# Altium project HuanserBoard.PrjPcb
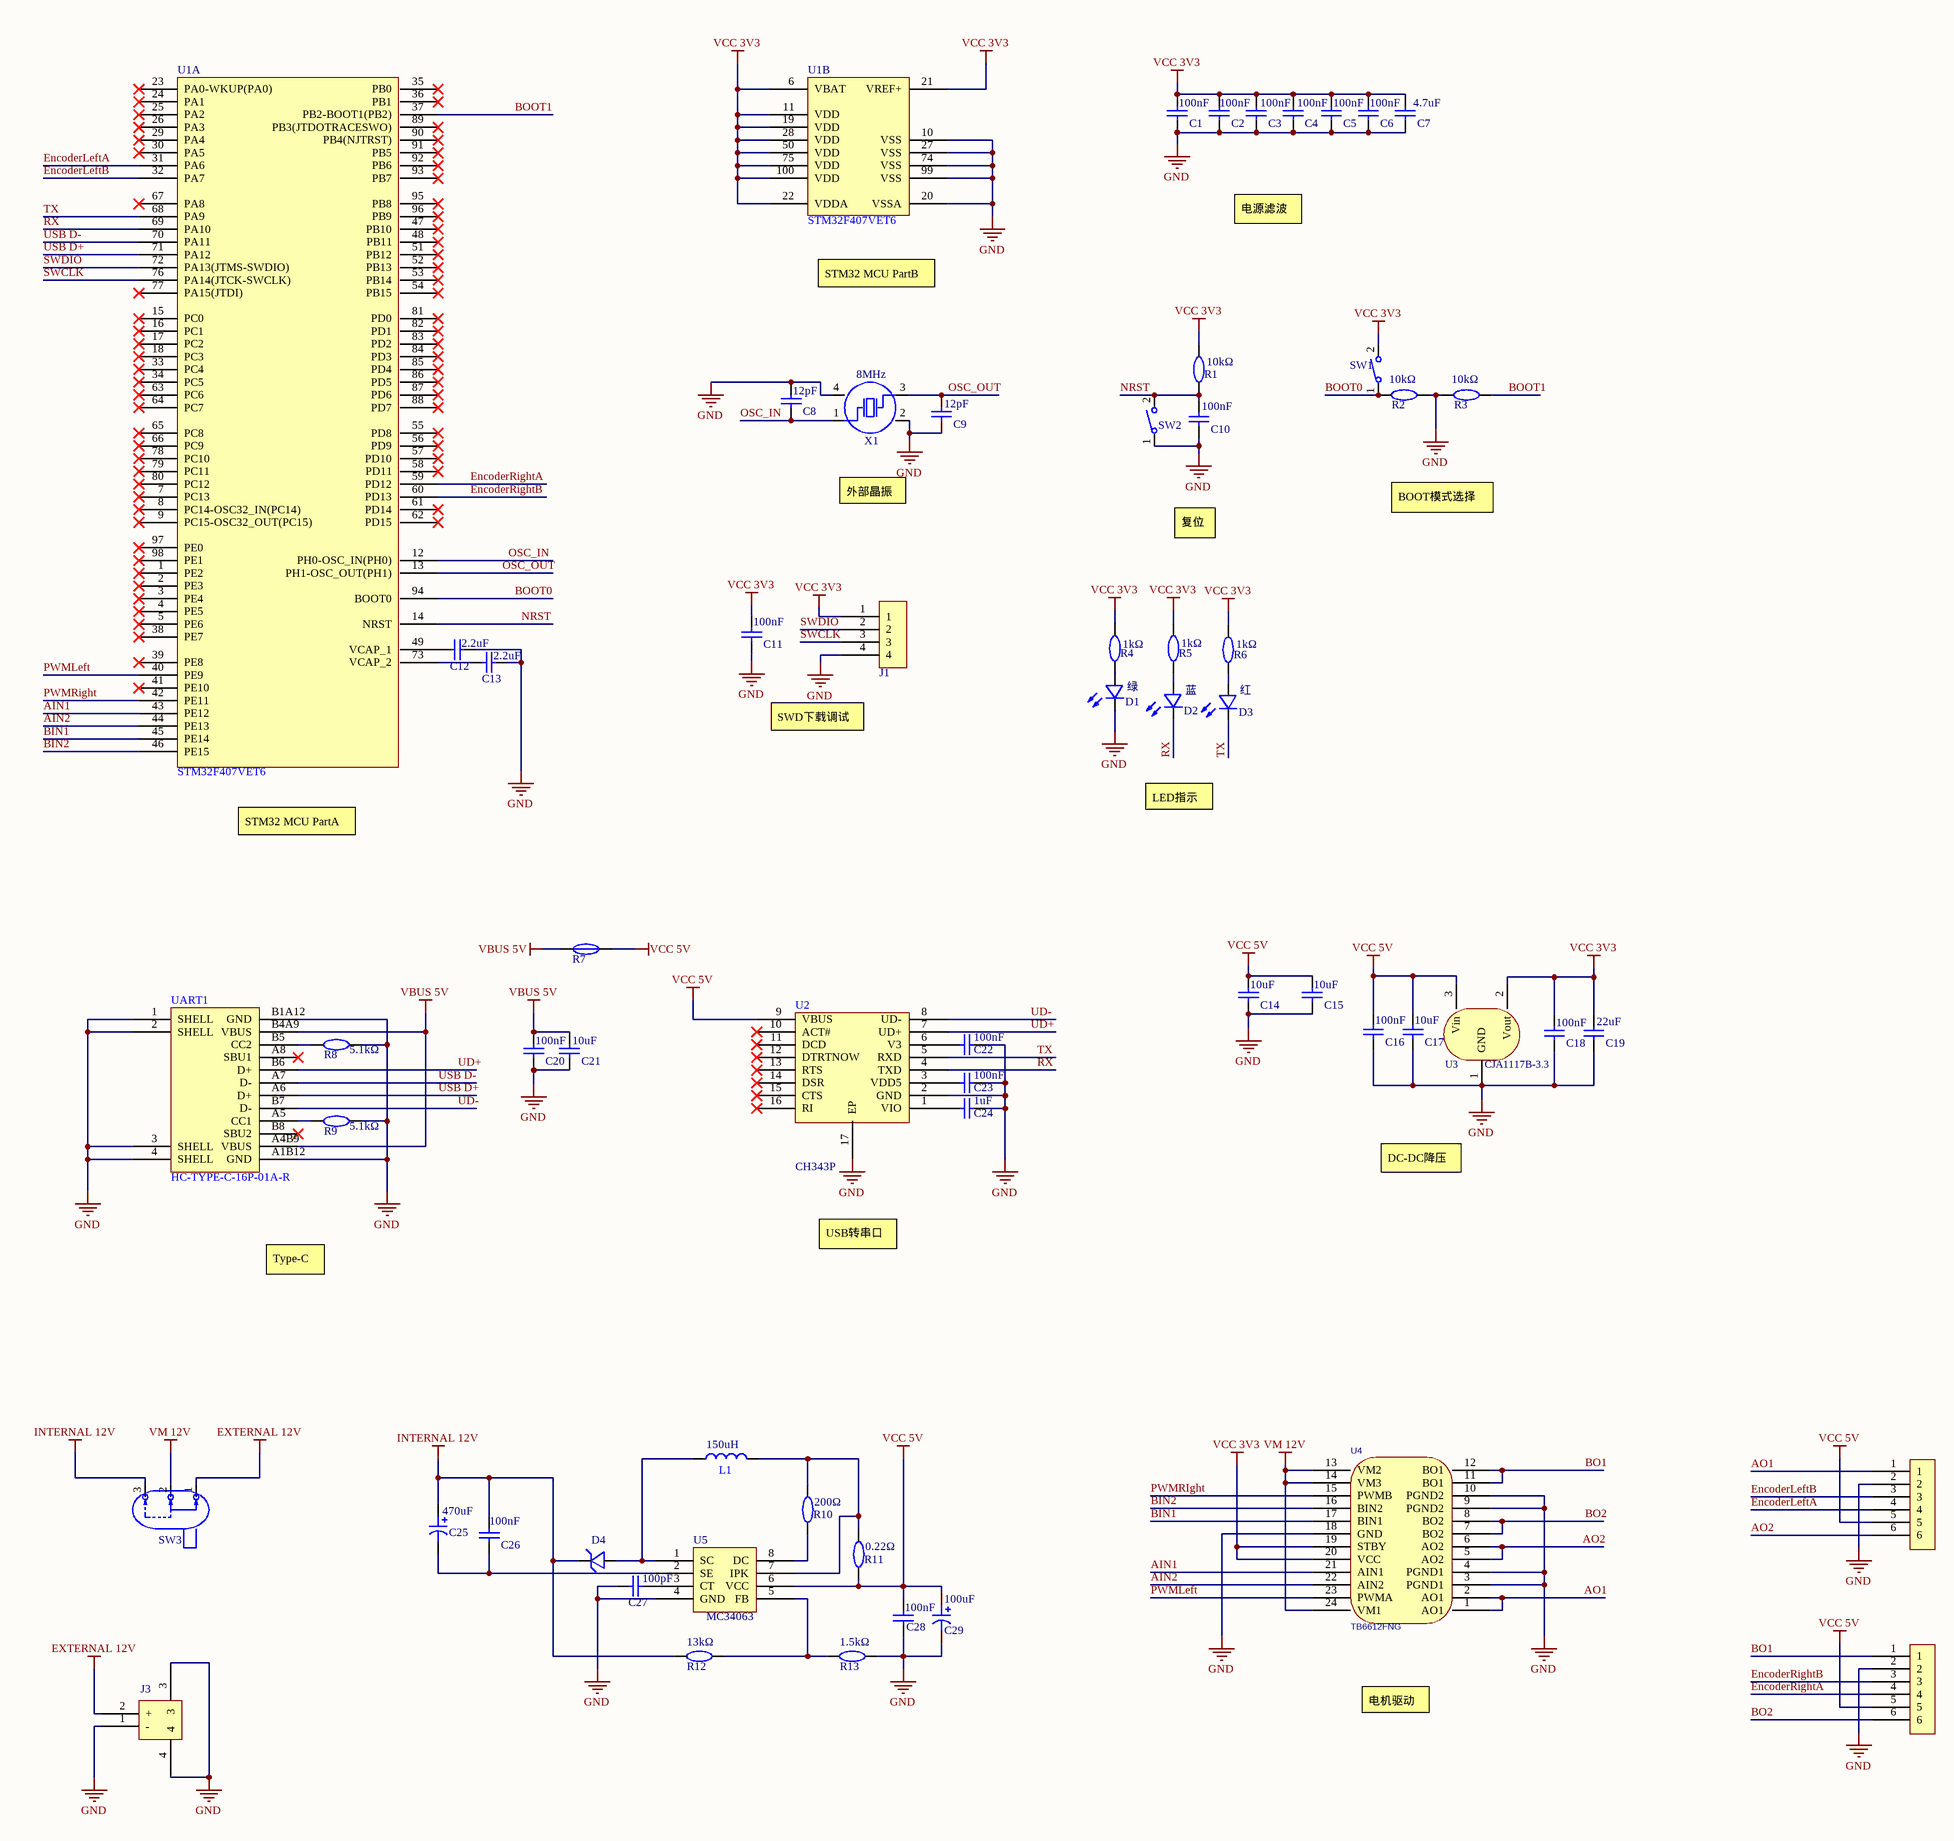
[diagram p0: MotorControl.SchDoc]
1 sheet, 61 parts. Net scope: global (net labels, ports and power ports of the same name join across sheets).
Board file: MotorControl.PcbDoc

## Sheet MotorControl.SchDoc
size A2

### Parts
C1  CAP-0402  [C0402]  (value not drawn)
C2  CAP-0402  [C0402]  (value not drawn)
C3  CAP-0402  [C0402]  (value not drawn)
C4  CAP-0402  [C0402]  (value not drawn)
C5  CAP-0402  [C0402]  (value not drawn)
C6  CAP-0402  [C0402]  (value not drawn)
C7  CAP-0402  [C0402]  (value not drawn)
C8  CAP-0402  [C0402]  (value not drawn)
C9  CAP-0402  [C0402]  (value not drawn)
C10  CAP-0402  [C0402]  (value not drawn)
C11  CAP-0402  [C0402]  (value not drawn)
C12  CAP-0402  [C0402]  (value not drawn)
C13  CAP-0402  [C0402]  (value not drawn)
C14  CAP-0402  [C0402]  (value not drawn)
C15  CAP-0402  [C0402]  (value not drawn)
C16  CAP-0402  [C0402]  (value not drawn)
C17  CAP-0402  [C0402]  (value not drawn)
C18  CAP-0402  [C0402]  (value not drawn)
C19  CAP-0402  [C0402]  (value not drawn)
C20  CAP-0402  [C0402]  (value not drawn)
C21  CAP-0402  [C0402]  (value not drawn)
C22  CAP-0402  [C0402]  (value not drawn)
C23  CAP-0402  [C0402]  (value not drawn)
C24  CAP-0402  [C0402]  (value not drawn)
C25  470uF  [CAP-SMD_BD6.3-L6.6-W6.6-LS7.6-RD]  (value not drawn)
C26  CAP-0402  [C0402]  (value not drawn)
C27  CAP-0402  [C0402]  (value not drawn)
C28  CAP-0402  [C0402]  (value not drawn)
C29  100uF  [CAP-SMD_BD6.3-L6.6-W6.6-LS7.2-FD]  (value not drawn)
D1  LED0805-RD  [LED0805-RD]  (value not drawn)
D2  LED0805-RD  [LED0805-RD]  (value not drawn)
D3  LED0805-RD  [LED0805-RD]  (value not drawn)
D4  SS34A  [SMA_L4.4-W2.6-LS5.1-RD]  (value not drawn)
J1  HDR-1X4  [HDR-TH_4P-P2.54-H-M-W10.4]  (value not drawn)
J2  WAFER-XH254WZ-6A  [CONN-TH_6P-P2.50_WAFER-XH254WZ-6A]  (value not drawn)
J3  XT30PW-M30.G.Y  [CONN-TH_XT30PW-M]  (value not drawn)
J4  WAFER-XH254WZ-6A  [CONN-TH_6P-P2.50_WAFER-XH254WZ-6A]  (value not drawn)
L1  (no value)  [IND-SMD_L12.5-W12.5_GSDRK127P]
R1  RES-0402  [R0402]  (value not drawn)
R2  RES-0402  [R0402]  (value not drawn)
R3  RES-0402  [R0402]  (value not drawn)
R4  RES-0402  [R0402]  (value not drawn)
R5  RES-0402  [R0402]  (value not drawn)
R6  RES-0402  [R0402]  (value not drawn)
R7  TLC F1206  [F1206]  (value not drawn)
R8  RES-0402  [R0402]  (value not drawn)
R9  RES-0402  [R0402]  (value not drawn)
R10  RES-0402  [R0402]  (value not drawn)
R11  RES-0402  [R0402]  (value not drawn)
R12  RES-0402  [R0402]  (value not drawn)
R13  RES-0402  [R0402]  (value not drawn)
SW1  Switch  [KEY-SMD_2P-L6.0-W3.6-P7.4-LS8.0-L]  (value not drawn)
SW2  Switch  [KEY-SMD_2P-L6.0-W3.6-P7.4-LS8.0-L]  (value not drawn)
SW3  Switch-弯插滑动开关  [SW-TH_3P-SS12D06-1]  (value not drawn)
U1  STM32F407VET6  [LQFP-100_L14.0-W14.0-P0.50-LS16.0-BL]  (parts A,B of 2)
U2  CH343P  [TQFN-16_L3.0-W3.0-P0.50-BL-EP1.7]
U3  CJA1117B-3.3  [SOT-89]
U4  TB6612FNG  [SSOP-24_L8.4-W5.8-P0.65-LS7.8-BL]
U5  MC34063  [SOP-8_L4.9-W3.9-P1.27-LS6.0-BL]
UART1  HC-TYPE-C-16P-01A-R  [USB-C-SMD_G-SWITCH_GT-USB-7010EN]
X1  OSC CRYSTAL-SMD_4P-L3.2-W2.5-BL  [CRYSTAL-SMD_4P-L3.2-W2.5-BL]  (value not drawn)

### Nets
EXTERNAL 12V: J3.2(+) SW3.1
GND: C1.1 C2.1 C3.1 C4.1 C5.1 C6.1 C7.1 C8.2 C9.1 C10.1 C11.1 C12.2 C13.2 C14.1 C15.1 C16.1 C17.1 C18.1 C19.1 C20.1 C21.1 C22.2 C23.2 C24.2 C27.1 C28.1 C29.2 D1.1(-) J1.4 J2.2 J3.1(-) J3.3 J3.4 J4.2 R2.2 R3.1 R8.2 R9.2 R13.2 SW2.1 U1.10(VSS) U1.20(VSSA) U1.27(VSS) U1.74(VSS) U1.99(VSS) U2.2(GND) U2.17(EP) U3.1(GND) U4.3(PGND1) U4.4(PGND1) U4.9(PGND2) U4.10(PGND2) U4.18(GND) U5.4(GND) UART1.1(SHELL) UART1.2(SHELL) UART1.3(SHELL) UART1.4(SHELL) UART1.A1B12(GND) UART1.B1A12(GND) X1.2(GND) X1.4(GND)
INTERNAL 12V: C25.1 C26.2 D4.1 R12.1 SW3.3
VBUS 5V: C20.2 C21.2 R7.1 UART1.A4B9(VBUS) UART1.B4A9(VBUS)
VCC 3V3: C1.2 C2.2 C3.2 C4.2 C5.2 C6.2 C7.2 C11.2 C18.2 C19.2 J1.1 R1.2 R4.2 R5.2 R6.2 SW1.2 U1.6(VBAT) U1.11(VDD) U1.19(VDD) U1.21(VREF+) U1.22(VDDA) U1.28(VDD) U1.50(VDD) U1.75(VDD) U1.100(VDD) U3.2(Vout) U4.19(STBY) U4.20(VCC)
VCC 5V: C14.2 C15.2 C16.2 C17.2 C28.2 C29.1 J2.5 J4.5 R7.2 R11.1 U2.9(VBUS) U3.3(Vin) U5.6(VCC)
VM 12V: SW3.2 U4.13(VM2) U4.14(VM3) U4.24(VM1)
AIN1: U1.43(PE12) U4.21(AIN1)
AIN2: U1.44(PE13) U4.22(AIN2)
AO1: J2.1 U4.1(AO1) U4.2(AO1)
AO2: J2.6 U4.5(AO2) U4.6(AO2)
BIN1: U1.45(PE14) U4.17(BIN1)
BIN2: U1.46(PE15) U4.16(BIN2)
BO1: J4.1 U4.11(BO1) U4.12(BO1)
BO2: J4.6 U4.7(BO2) U4.8(BO2)
BOOT0: R2.1 SW1.1 U1.94(BOOT0)
BOOT1: R3.2 U1.37(PB2-BOOT1(PB2))
EncoderLeftA: J2.4 U1.31(PA6)
EncoderLeftB: J2.3 U1.32(PA7)
EncoderRightA: J4.4 U1.59(PD12)
EncoderRightB: J4.3 U1.60(PD13)
NRST: C10.2 R1.1 SW2.2 U1.14(NRST)
OSC_IN: C8.1 U1.12(PH0-OSC_IN(PH0)) X1.1(OSC1)
OSC_OUT: C9.2 U1.13(PH1-OSC_OUT(PH1)) X1.3(OSC2)
PWMLeft: U1.40(PE9) U4.23(PWMA)
PWMRIght: U1.42(PE11) U4.15(PWMB)
RX: D2.1(-) U1.69(PA10) U2.4(TXD)
SWCLK: J1.3 U1.76(PA14(JTCK-SWCLK))
SWDIO: J1.2 U1.72(PA13(JTMS-SWDIO))
TX: D3.1(-) U1.68(PA9) U2.5(RXD)
UD+: U2.7(UD+) UART1.B6(D+)
UD-: U2.8(UD-) UART1.B7(D-)
USB D+: U1.71(PA12) UART1.A6(D+)
USB D-: U1.70(PA11) UART1.A7(D-)
NetC12_1: C12.1 U1.49(VCAP_1)
NetC13_1: C13.1 U1.73(VCAP_2)
NetC22_1: C22.1 U2.6(V3)
NetC23_1: C23.1 U2.3(VDD5)
NetC24_1: C24.1 U2.1(VIO)
NetC25_2: C25.2 C26.1 U5.2(SE)
NetC27_2: C27.2 U5.3(CT)
NetD1_2: D1.2(+) R4.1
NetD2_2: D2.2(+) R5.1
NetD3_2: D3.2(+) R6.1
NetD4_2: D4.2 L1.1 U5.1(SC)
NetL1_2: L1.2 R10.2 R11.2 U5.7(IPK)
NetR8_1: R8.1 UART1.B5(CC2)
NetR9_1: R9.1 UART1.A5(CC1)
NetR10_1: R10.1 U5.8(DC)
NetR12_2: R12.2 R13.1 U5.5(FB)

Not connected (* = marked no-connect by the designer): U1 1(PE2)* 2(PE3)* 3(PE4)* 4(PE5)* 5(PE6)* 7(PC13)* 8(PC14-OSC32_IN(PC14))* 9(PC15-OSC32_OUT(PC15))* 15(PC0)* 16(PC1)* 17(PC2)* 18(PC3)* 23(PA0-WKUP(PA0))* 24(PA1)* 25(PA2)* 26(PA3)* 29(PA4)* 30(PA5)* 33(PC4)* 34(PC5)* 35(PB0)* 36(PB1)* 38(PE7)* 39(PE8)* 41(PE10)* 47(PB10)* 48(PB11)* 51(PB12)* 52(PB13)* 53(PB14)* 54(PB15)* 55(PD8)* 56(PD9)* 57(PD10)* 58(PD11)* 61(PD14)* 62(PD15)* 63(PC6)* 64(PC7)* 65(PC8)* 66(PC9)* 67(PA8)* 77(PA15(JTDI))* 78(PC10)* 79(PC11)* 80(PC12)* 81(PD0)* 82(PD1)* 83(PD2)* 84(PD3)* 85(PD4)* 86(PD5)* 87(PD6)* 88(PD7)* 89(PB3(JTDOTRACESWO))* 90(PB4(NJTRST))* 91(PB5)* 92(PB6)* 93(PB7)* 95(PB8)* 96(PB9)* 97(PE0)* 98(PE1)*; U2 10(ACT#)* 11(DCD)* 12(DTRTNOW)* 13(RTS)* 14(DSR)* 15(CTS)* 16(RI)*; UART1 A8(SBU1)* B8(SBU2)*

### Notes on the sheet
- (near C1) 100nF
- (near C2) 100nF
- 100nF
- (near C5) 100nF
- (near C6) 100nF
- (near C7) 4.7uF
- 电源滤波
- STM32 MCU PartB
- (near X1) 8MHz
- (near R1) 10kΩ
- 10kΩ
- (near R3) 10kΩ
- (near C8) 12pF
- (near C9) 12pF
- (near C10) 100nF
- 外部晶振
- BOOT模式选择
- 复位
- (near C11) 100nF
- (near C12) 2.2uF
- (near C13) 2.2uF
- (near R4) 1kΩ
- (near D1) 绿
- (near R5) 1kΩ
- (near D2) 蓝
- (near R6) 1kΩ
- (near D3) 红
- SWD下载调试
- STM32 MCU PartA
- LED指示
- (near C14) 10uF
- (near C15) 10uF
- (near R8) 5.1kΩ
- (near C21) 10uF
- (near C22) 100nF
- (near C23) 100nF
- (near C16) 100nF
- (near C17) 10uF
- (near C18) 100nF
- (near C19) 22uF
- (near R9) 5.1kΩ
- (near C24) 1uF
- DC-DC降压
- Type-C
- USB转串口
- (near L1) 150uH
- (near C25) 470uF
- (near C26) 100nF
- (near R10) 200Ω
- (near C27) 100pF
- (near R11) 0.22Ω
- (near R12) 13kΩ
- (near R13) 1.5kΩ
- (near C28) 100nF
- (near C29) 100uF
- 电机驱动

### Library data of the parts
C1-C24 C26-C28 = CAP-0402: 0402贴片电容; Manufacturer: SAMSUNG(三星); Symbol: CL21B104KBCNNNC; Add into BOM: yes; Tolerance: ±10%; Voltage Rated: 50V; Temperature Coefficient: X7R; Device: CL21B104KBCNNNC; LCSC Part Name: 100nF ±10% 50V; Supplier Part: C1711; Manufacturer Part: CL21B104KBCNNNC; Supplier Footprint: 0805; JLCPCB Part Class: Extended Part; Datasheet: https://atta.szlcsc.com/upload/public/pdf/source/20160103/1457707693305.pdf; Supplier: LCSC; Convert to PCB: yes
C25 = RVT1C471M0607: 铝电解电容 470uF; Manufacturer: ROQANG(容强); Add into BOM: yes; Tolerance: ±20%; Rated Voltage: 16V; Ripple Current: 185mA@120Hz; φD: 6.3mm; L: 7.7mm; Lifetime @ Temp: 2000hrs@105℃; Symbol: RVT1C471M0607; Device: RVT1C471M0607; LCSC Part Name: 470uF ±20% 16V; Supplier Part: C2977552; Manufacturer Part: RVT1C471M0607; Supplier Footprint: SMD,D6.3xL7.7mm; JLCPCB Part Class: Extended Part; Datasheet: https://atta.szlcsc.com/upload/public/pdf/source/20220223/DD822675CC1DF2F0C06D5C2255C9C2D9.pdf; Supplier: LCSC; Convert to PCB: yes; Value: 470uF; Operating Temperature: -40℃~+105℃
C29 = RVT100UF16V67RV0016: 铝电解电容 100uF; Manufacturer: KNSCHA(科尼盛); Add into BOM: yes; Tolerance: ±20%; Rated Voltage: 16V; Ripple Current: 93mA@120Hz; φD: 6.3mm; L: 5.4mm; Lifetime @ Temp: 2000hrs@105℃; Symbol: RVT100UF16V67RV0016; Device: RVT100UF16V67RV0016; LCSC Part Name: 100uF ±20% 16V; Supplier Part: C2887276; Manufacturer Part: RVT100UF16V67RV0016; Supplier Footprint: SMD,D6.3xL5.4mm; JLCPCB Part Class: Extended Part; Datasheet: https://atta.szlcsc.com/upload/public/pdf/source/20240521/3810EB5B434F72326C196D6A9426C70A.pdf; Supplier: LCSC; Convert to PCB: yes; Value: 100uF; Equivalent Series Resistance(ESR): -; Operating Temperature: -55℃~+105℃
D1-D3 = LED0805-RD: LED; Manufacturer: MEIHUA(美华科技); Symbol: MHT170UBCT; Add into BOM: yes; Lens Color: 无色透明; Dominant Wavelength: 460nm~475nm; Peak Wavelength: 468nm; Forward Current: 20mA; Forward Voltage (VF): 3.3V; Luminous Intensity: 225mcd; Power Dissipation: 95mW; Viewing Angle: 140°; Device: MHT170UBCT; LCSC Part Name: LED贴片0805超高亮蓝光; Supplier Part: C389525; Manufacturer Part: MHT170UBCT; Supplier Footprint: 0805; JLCPCB Part Class: Extended Part; Datasheet: https://atta.szlcsc.com/upload/public/pdf/source/20190515/C389525_9DDE5770D44EFFE682D3E1E38A61D6F4.pdf; Supplier: LCSC; Convert to PCB: yes; Diode Configuration: -; Color Temperature: -; Luminous Flux (@25℃): -; Mounting Sytle: -; Operating Temperature: -40~+85
D4 = SS34A_C2886580: 肖特基二极管; Manufacturer: Hottech(合科泰); Add into BOM: yes; Diode Configuration: 独立式; Forward Voltage (Vf@If): 500mV@3A; Reverse Voltage (Vr): 40V; Rectified Current: 3A; Reverse Leakage Current (Ir): 500uA@40V; Symbol: SS34A_C2886580; Device: SS34A_C2886580; LCSC Part Name: 电压:40V 电流:3A; Supplier Part: C2886580; Manufacturer Part: SS34A; Supplier Footprint: SMA(DO-214AC); JLCPCB Part Class: Extended Part; Datasheet: https://atta.szlcsc.com/upload/public/pdf/source/20220428/CC15BDAC1896772FBF35067304521A73.pdf; Supplier: LCSC; Convert to PCB: yes
J1 = HDR-1X4-弯排针: 1X4弯排针; Symbol: PZ254V-11-04P; Device: HDR-M_2.54_1x4P; Convert to PCB: yes; Add into BOM: yes; Supplier Part: C2935929; Supplier Footprint: 插件
J2 J4 = WAFER-XH254WZ-6A: XH2.54 6P弯插公头; Manufacturer: HANBO(汉博); Add into BOM: yes; Pins Structure: 1x6P; Pitch: 2.54mm; Reference Series: XH; Number of PINs Per Row: 6; Current Rating (Max): 3A; Symbol: WAFER-XH254WZ-6A; Device: WAFER-XH254WZ-6A; LCSC Part Name: WAFER-XH254WZ-6A; Supplier Part: C7432695; Manufacturer Part: WAFER-XH254WZ-6A; Supplier Footprint: 插件,P=2.5mm; JLCPCB Part Class: Extended Part; Datasheet: https://atta.szlcsc.com/upload/public/pdf/source/20230721/127D646758C1D4B76FEF9901992220E1.pdf; Supplier: LCSC; Convert to PCB: yes; Mounting Style: 弯插; Number of Pins: 6P; Number of Rows: 1; Operating Temperature Range: -25℃~+85℃
J3 = XT30PW-M30.G.Y: XT30公头; Manufacturer: AMASS(艾迈斯); Add into BOM: yes; RatedVoltage: DC 500V; InterfaceType: 公头; RatedCurrent: 15A; RecommendedWireGauge: 16/18/20AWG; contact resistance: 1.2mΩ; specifications: 2pin; Symbol: XT30PW-M; Device: XT30PW-M30.G.Y; LCSC Part Name: AMASS(艾迈斯)航模插头 卧式弯脚 XT30PW-M公头; Supplier Part: C431092; Manufacturer Part: XT30PW-M30.G.Y; Supplier Footprint: -; JLCPCB Part Class: Extended Part; Datasheet: https://atta.szlcsc.com/upload/public/pdf/source/20220222/6A9F22F7850E25B33E1BE430ADF8560B.pdf; Supplier: LCSC; Convert to PCB: yes; Power: -; Output: -; Input: -; Size: -; Interface: -; Type: 航模插头; Colour: -; MaximumCurrent: -; Type1: -; NumberOfUSBHoles: -; MetalMaterial: -; InsulationMaterial: -; FlameRetardantGrade: -; Belt length: -
L1 = HX CYH125-150UH: 150uH贴片电感; Manufacturer: hanxia(韩下); Add into BOM: yes; Value: 150uH; Tolerance: ±20%; Rated Current: 2.1A; DC Resistance (DCR): 140mΩ; Symbol: HX CYH125-150UH; Device: HX CYH125-150UH; LCSC Part Name: 150uH ±20%; Supplier Part: C7587714; Manufacturer Part: HX CYH125-150UH; Supplier Footprint: SMD,12.5x12.5mm; JLCPCB Part Class: Extended Part; Datasheet: https://atta.szlcsc.com/upload/public/pdf/source/20230829/62AFB8ACEA0AE28F73050A77CC19A792.pdf; Supplier: LCSC; Convert to PCB: yes
R1-R6 R8-R13 = RES-0402: 0402贴片电阻; Manufacturer: FH(风华); Symbol: RS-05K102JT; Add into BOM: yes; Tolerance: ±5%; Power(Watts): 125mW; Temperature Coefficient: ±100ppm/; Overload Voltage (Max): 150V; Device: RS-05K102JT; LCSC Part Name: 1kΩ ±5%; Supplier Part: C115302; Manufacturer Part: RS-05K102JT; Supplier Footprint: 0805; JLCPCB Part Class: Extended Part; Datasheet: https://atta.szlcsc.com/upload/public/pdf/source/20170704/1499151304704.pdf; Supplier: LCSC; Convert to PCB: yes; Operating Temperature Range: -55~+155
R7 = TLC F1206: 保险丝; Manufacturer: TLC(竞沃); Symbol: TLC-NSMD100; Add into BOM: yes; Operating Voltage (Max): 6V; Current Rating (Max): 100A; Hold Current: 1A; Trip Current: 2A; Power Dissipation: 600mW; Maximum Time to Trip: 100ms; Device: TLC-NSMD100; LCSC Part Name: 6V 1A 自恢复; Supplier Part: C261954; Manufacturer Part: TLC-NSMD100; Supplier Footprint: 1206; JLCPCB Part Class: Extended Part; Datasheet: https://atta.szlcsc.com/upload/public/pdf/source/20180802/C261954_CE31CE21EEB143DB51778C363DF0F083.pdf; Supplier: LCSC; Convert to PCB: yes; Resistance - Initial (Ri) (Min): -; Resistance - Post Trip (R1) (Max): -; Operating Temperature: -40~+85
SW1 SW2 = Switch: 滑动开关; Manufacturer: XKB Connectivity(中国星坤); Symbol: TS-1101-B-W; Device: TS-1101-B-W_C500065; Add into BOM: yes; Contact Current: 50mA; Voltage Rating (DC): 12V; Circuit: 单刀单掷; Actuator Style: 矩形按钮; Actuator/Cap Color: 白色; With Lamp: 无; Operating Force: 160gf; Mechanical Life: 5万次; Switch Length: 6mm; Switch Width: 3.6mm; Switch Height: 2.5mm; Strike Gundam: 否; LCSC Part Name: 6*3.6*2.5mm 立贴 轻触开关; Supplier Part: C500065; Manufacturer Part: TS-1101-B-W; Supplier Footprint: SMD; JLCPCB Part Class: 扩展库; Datasheet: https://atta.szlcsc.com/upload/public/pdf/source/20211011/D0E0CAF534F7B19DDE4CE68748A25BD3.pdf; Supplier: LCSC; Convert to PCB: yes; Insulation Resistance: -; Mounting Style: 立贴; Operating Temperature: -30℃~+85℃
SW3 = Switch-弯插滑动开关: 弯插滑动开关; Manufacturer: SHOU HAN(首韩); Symbol: SS12D10G5-WJ; Add into BOM: yes; Circuit: 单刀双掷; Switch Length: 12.7mm; Switch Width: 6.7mm; Current Rating (DC): 2A; Voltage Rating (DC): 125V; Mechanical Life: 3千次; Device: SS12D10G5-WJ; LCSC Part Name: 两档卧式插件 3脚拨动开关弯插 柄长5.0mm; Supplier Part: C7431058; Manufacturer Part: SS12D10G5-WJ; Supplier Footprint: 插件; JLCPCB Part Class: Extended Part; Datasheet: https://atta.szlcsc.com/upload/public/pdf/source/20230621/24203FB22DE8BDD2A5BD75F3B5E716C8.pdf; Supplier: LCSC; Convert to PCB: yes; Mounting Style: 直插; Operating Temperature: -25℃~+70℃
U1 = STM32F407VET6: STM32F407VET6 MCU; Manufacturer: ST(意法半导体); Add into BOM: yes; CPU Core: CM4; Program Storage Size: 512KB; RAM Size: 192KB; GPIO Ports Number: 82; Operating Voltage Range: 1.8V~3.6V; CPU Maximum Speed: 168MHz; Program Memory Type: FLASH; ADC (Bit): 12bit; Universal Serial Bus: 有; Peripheral/Function: DMA；LCD/LED驱动；PWM; Symbol: STM32F407VET6; Device: STM32F407VET6; LCSC Part Name: STM32F407VET6; Supplier Part: C28730; Manufacturer Part: STM32F407VET6; Supplier Footprint: LQFP-100(14x14); JLCPCB Part Class: 扩展库; Datasheet: https://atta.szlcsc.com/upload/public/pdf/source/20140801/1457707197138.pdf; Supplier: LCSC; Convert to PCB: yes; Operating Temperature Range: -40℃~+85℃; DAC (Bit): 12bit; PWM (Bit): -; Internal Comparator: -; communication protocol: -; Watchdog: 有; Real-Time Clock: -; Infrared Data Association: 有; Low-Voltage Detect: 有; CCP Capture/Compare: -; LCD Module: 有; Secure Digital Input and Output: -; Direct Memory Access: 有; Internal Oscillator: 有
U2 = CH343P: USB转串口; Manufacturer: WCH(南京沁恒); Add into BOM: yes; Symbol: CH343P; Device: CH343P; Supplier Part: C2846043; Manufacturer Part: CH343P; Supplier Footprint: QFN-16; JLCPCB Part Class: 扩展库; Datasheet: https://atta.szlcsc.com/upload/public/pdf/source/20211010/C2846043_7FA705E1F14A2906F6A2AFA45FA28209.pdf; Supplier: LCSC; Convert to PCB: yes; Type: -; Protocol: -; Number of Drivers/Receivers: -; Data Rate: -; Supply Voltage: -
U3 = CJA1117B-3.3: 3.3V线性稳压器
U4 = TB6612FNG: TB6612FNG电机驱动; 联系卖家，免费查找封装: 唯一出售店铺网址https://shop463601444.taobao.com; BOM名称: TB6612FNG
U5 = MC34063_C6454474: DC-DC电源芯片; Manufacturer: MSKSEMI(美森科); Add into BOM: yes; Output Type: 可调; Input Voltage: 3V~40V; Number of Outputs: 1; Switch tube (built-in/external): 内置; Symbol: MC34063_C6454474; Device: MC34063_C6454474; LCSC Part Name: 单片DC-DC变换集成电路; Supplier Part: C6454474; Manufacturer Part: MC34063; Supplier Footprint: SOP-8; JLCPCB Part Class: Extended Part; Datasheet: https://atta.szlcsc.com/upload/public/pdf/source/20230524/F84E18146E118B80C4325CCA333FE83E.pdf; Supplier: LCSC; Convert to PCB: yes; Function: -; Output Voltage: -; Output Current: -; Switching Frequency: -; Operating Temperature: 0℃~+70℃; Synchronous Rectification: -; Topology: -; Quiescent Current (Iq): -
UART1 = HC-TYPE-C-16P-01A-R: Type-C接口; Manufacturer: HCTL(华灿天禄); Add into BOM: yes; Connector Type: Type-C; Gender: 母座; Number of Contacts: 16; Number of Ports: 1; Symbol: HC-TYPE-C-16P-01A-R; Device: HC-TYPE-C-16P-01A-R; LCSC Part Name: Type-C 母座 卧贴; Supplier Part: C2997433; Manufacturer Part: HC-TYPE-C-16P-01A-R; Supplier Footprint: SMD; Datasheet: https://atta.szlcsc.com/upload/public/pdf/source/20220415/23B51DCADC5F28223C40C3605487ACA1.pdf; Supplier: LCSC; Convert to PCB: yes; Mounting Style: 卧贴
X1 = OSC CRYSTAL-SMD_4P-L3.2-W2.5-BL: 四脚晶振; Manufacturer: JGHC(晶光华); Symbol: S3212000201080; Add into BOM: yes; Crystal Type: 贴片无源晶振; Frequency Tolerance: ±10ppm; Load Capacitance: 20pF; Equivalent Series Resistance (ESR): 80Ω; Device: S3212000201080; LCSC Part Name: 12MHz ±10ppm 20pF; Supplier Part: C426972; Manufacturer Part: S3212000201080; Supplier Footprint: SMD3225-4P; JLCPCB Part Class: Extended Part; Datasheet: https://atta.szlcsc.com/upload/public/pdf/source/20191012/C426972_E2C41F8C78BF72E52773F7737EA32F83.pdf; Supplier: LCSC; Convert to PCB: yes; Frequency Stability: -; Operating Temperature: -40~+85